# EAGLE design RC filter (EAGLE 7.2.0)
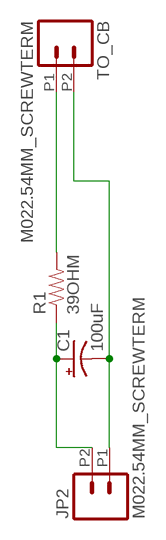
[diagram p0: schematic, sheet 1]

## Parts
C1  100uF  100UF-10V-10%(TANT)  [EIA7343]
JP2  M022.54MM_SCREWTERM  [1X02_2.54_SCREWTERM]
R1  39OHM  33OHM1/10W1%(0603)  [0603]
TO_CB  M022.54MM_SCREWTERM  [1X02_2.54_SCREWTERM]

## Nets
GND: C1.C(-) JP2.P1 TO_CB.P2
N$1: R1.2 TO_CB.P1
N$2: C1.A(+) JP2.P2 R1.1

## Library data of the parts
C1 = SparkFun-Capacitors:100UF-10V-10%(TANT): CAP-07890; PROD_ID: CAP-07890
JP2 TO_CB = SparkFun-Connectors:M02: Standard 2-pin 0.1" header. Use with - straight break away headers ( PRT-00116) - right angle break away headers (PRT-00553) - swiss pins (PRT-00743) - machine pins (PRT-00117) - female headers (PRT-00115) Molex polarized connector foot print use with: PRT-08233 with associated crimp pins and housings. 2.54_SCREWTERM for use with PRT-10571. 3.5mm Screw Terminal footprints for PRT-08084 5mm Screw Terminal footprints for use with PRT-08432
R1 = SparkFun-Resistors:33OHM1/10W1%(0603): RES-08270; PROD_ID: RES-08270; VALUE: 33OHM

## Board
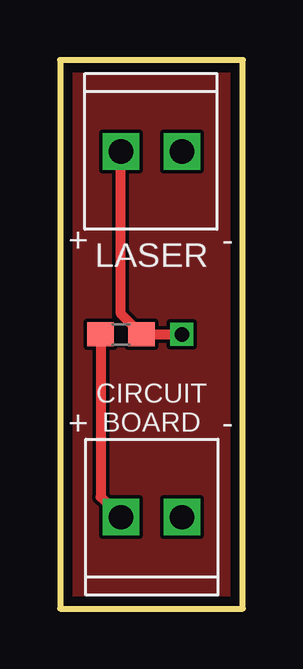
[diagram p1: board, top side]
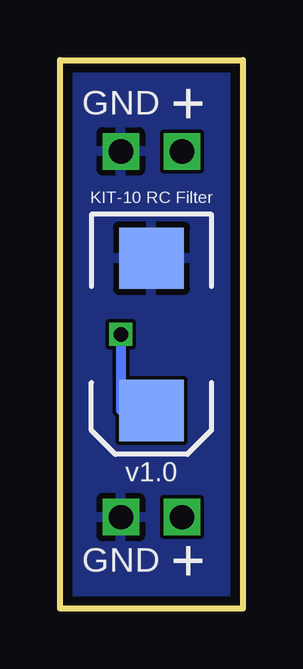
[diagram p2: board, bottom side, seen from below]

Size 7.62 x 22.86 mm. Coordinates in mm from the lower left corner, seen from the top.
Outline: 0,0 7.62,0 7.62,22.86 0,22.86 0,0
Copper layers (1*16): Top 0.0356mm / dielectric 1.5011mm / Bottom 0.0356mm
Design rules "LaenPCBOrder": minimum track width 6mil, minimum drill 13mil, track to track 6mil, track to pad 6mil, pad to pad 6mil, via to via 6mil, smd to smd 6mil, copper to edge 15mil, drill to drill 6mil, minimum pad ring 7mil, minimum via ring 7mil, stop-mask expansion 3mil, vias tented up to drill 0mil, thermal gap 10mil

### Footprints (pad centres in the part's own frame; a part is rotated, then mirrored left to right if it is on the bottom)
EIA7343 = smd 2.55 x 2.7: A 3.17,0; C -3.17,0
1X02_2.54_SCREWTERM = drill 1.016 square: P1 2.54,0; P2 0,0
0603 = smd 1.1 x 1: 1 -0.85,0; 2 0.85,0

### Placement (x,y rotation side)
C1  3.81,11.43 270 bottom
JP2  2.54,19.05 0 top
R1  2.54,11.43 180 top
TO_CB  5.08,3.81 180 top

### Tracks (layer width: path | path; a pad name or v marks a point on that pad's centre or on a via)
GND
  pour Bottom: 0,0 7.62,0 7.62,22.86 0,22.86
N$1
  Top 0.406: R1.2 1.69,4.66 TO_CB.P1
N$2  (via drill 0.6)
  Top 0.406: JP2.P2 2.54,12.28 R1.1 v5.08,11.43
  Bottom 0.406: 3.17,8.89 C1.A 5.08,8.26 v5.08,11.43
N$5
  pour Top: 0,0 7.62,0 7.62,22.86 0,22.86

### Text on the board
tNames: + | LASER | - | + | CIRCUIT / BOARD | -
bNames: + | GND | KIT-10 RC Filter | v1.0 | + | GND